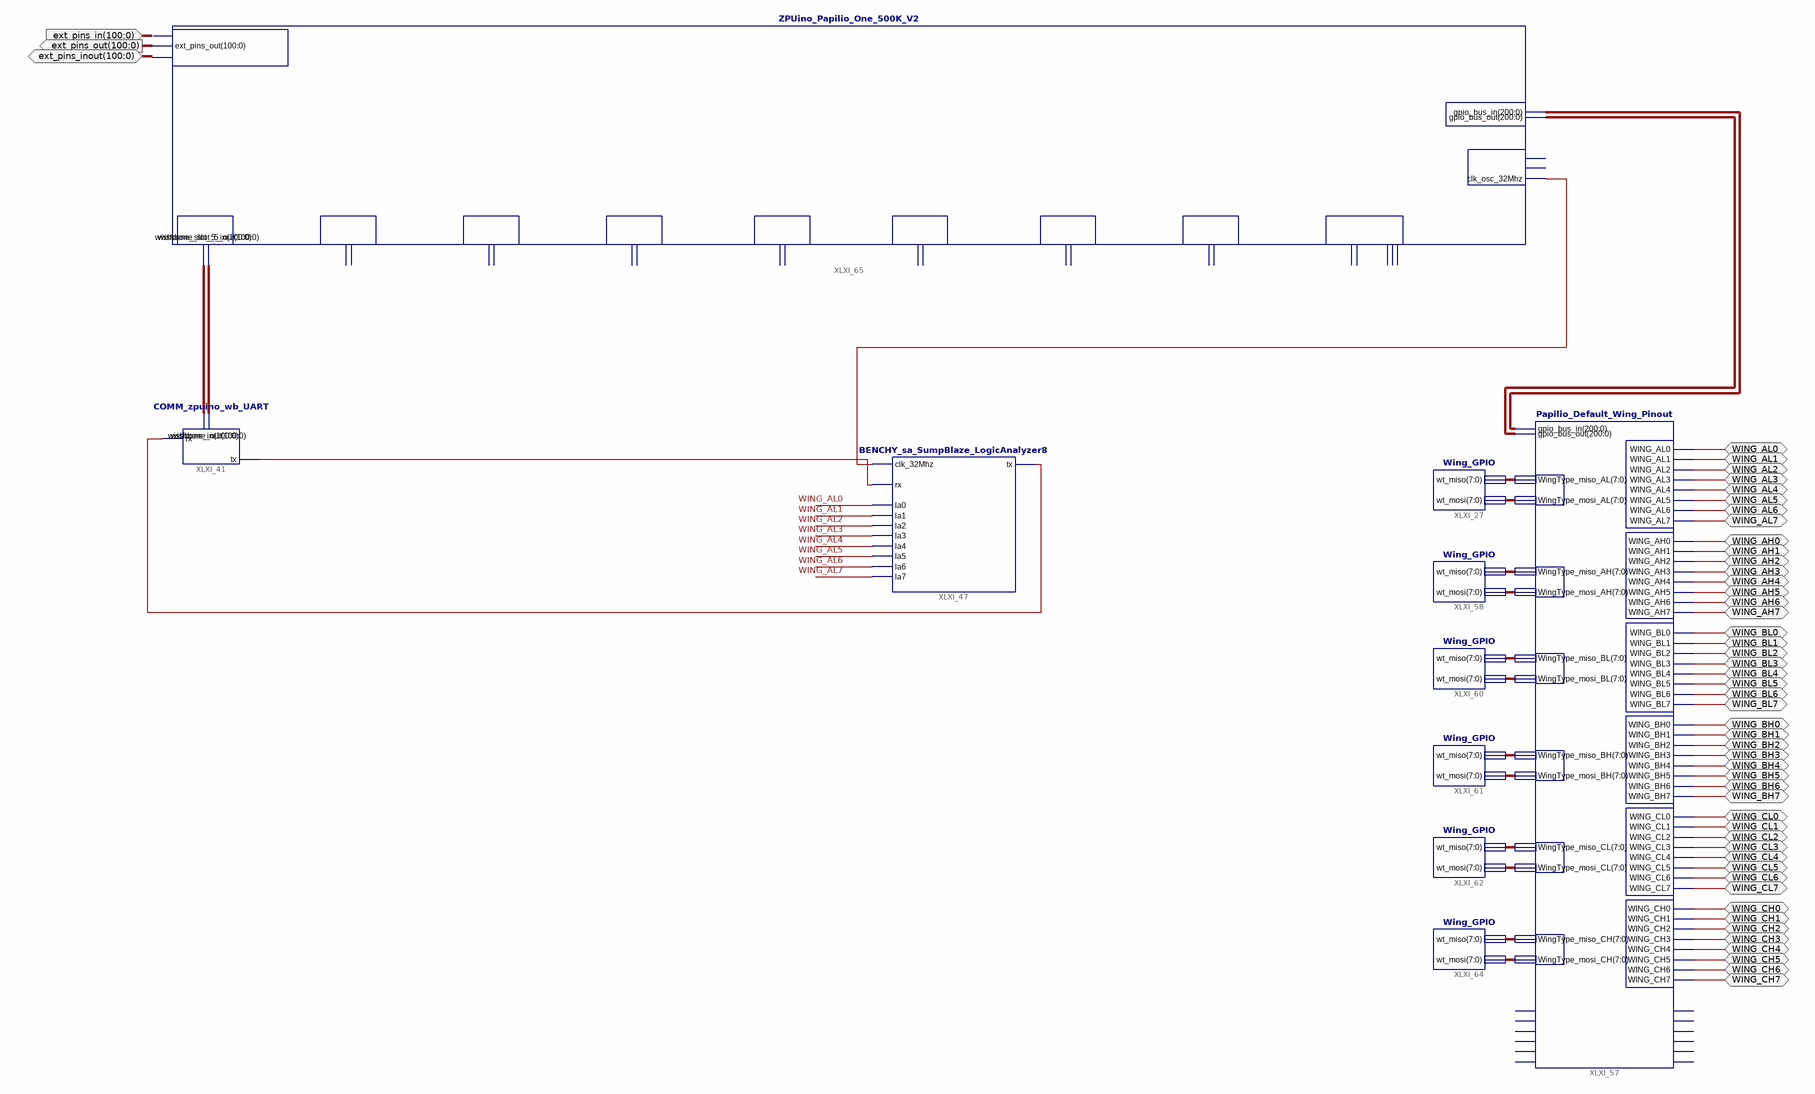
[diagram p0: schematic sheet 1]
// Xilinx ISE schematic Papilio_One_500K.sch (spartan3e) as structural Verilog: 10 symbols, 51 ports
module Papilio_One_500K (
  input  [100:0] ext_pins_in,
  inout  WING_AL0,
  inout  WING_AL1,
  inout  WING_AL2,
  inout  WING_AL3,
  inout  WING_AL4,
  inout  WING_AL5,
  inout  WING_AL6,
  inout  WING_AL7,
  inout  WING_AH0,
  inout  WING_AH1,
  inout  WING_AH2,
  inout  WING_AH3,
  inout  WING_AH4,
  inout  WING_AH5,
  inout  WING_AH6,
  inout  WING_AH7,
  inout  WING_BL0,
  inout  WING_BL1,
  inout  WING_BL2,
  inout  WING_BL3,
  inout  WING_BL4,
  inout  WING_BL5,
  inout  WING_BL6,
  inout  WING_BL7,
  inout  WING_BH0,
  inout  WING_BH1,
  inout  WING_BH2,
  inout  WING_BH3,
  inout  WING_BH4,
  inout  WING_BH5,
  inout  WING_BH6,
  inout  WING_BH7,
  inout  WING_CL0,
  inout  WING_CL1,
  inout  WING_CL2,
  inout  WING_CL3,
  inout  WING_CL4,
  inout  WING_CL5,
  inout  WING_CL6,
  inout  WING_CL7,
  inout  WING_CH0,
  inout  WING_CH1,
  inout  WING_CH2,
  inout  WING_CH3,
  inout  WING_CH4,
  inout  WING_CH5,
  inout  WING_CH6,
  inout  WING_CH7,
  inout  [100:0] ext_pins_inout,
  output [100:0] ext_pins_out
);

  wire XLXN_457, XLXN_466, XLXN_468;
  wire [7:0] XLXN_489, XLXN_490, XLXN_491, XLXN_492, XLXN_493, XLXN_494, XLXN_495, XLXN_496, XLXN_497,
       XLXN_498, XLXN_499, XLXN_500;
  wire [100:0] XLXN_509, XLXN_510;
  wire [200:0] XLXN_408, XLXN_409;

  Wing_GPIO XLXI_27 (.wt_miso(XLXN_489), .wt_mosi(XLXN_490));
  BENCHY_sa_SumpBlaze_LogicAnalyzer8 #(.brams(1)) XLXI_47 (
    .clk_32Mhz(XLXN_457), .la0(WING_AL0), .rx(XLXN_466), .tx(XLXN_468), .la1(WING_AL1), .la2(WING_AL2),
    .la3(WING_AL3), .la4(WING_AL4), .la5(WING_AL5), .la6(WING_AL6), .la7(WING_AL7));
  Papilio_Default_Wing_Pinout XLXI_57 (
    .WING_AH0(WING_AH0), .WING_AH1(WING_AH1), .WING_AH2(WING_AH2), .WING_AH3(WING_AH3), .WING_AH4(WING_AH4),
    .WING_AH5(WING_AH5), .WING_AH6(WING_AH6), .WING_AH7(WING_AH7), .WING_AL0(WING_AL0), .WING_AL1(WING_AL1),
    .WING_AL2(WING_AL2), .WING_AL3(WING_AL3), .WING_AL4(WING_AL4), .WING_AL5(WING_AL5), .WING_AL6(WING_AL6),
    .WING_AL7(WING_AL7), .WING_BH0(WING_BH0), .WING_BH1(WING_BH1), .WING_BH2(WING_BH2), .WING_BH3(WING_BH3),
    .WING_BH4(WING_BH4), .WING_BH5(WING_BH5), .WING_BH6(WING_BH6), .WING_BH7(WING_BH7), .WING_BL0(WING_BL0),
    .WING_BL1(WING_BL1), .WING_BL2(WING_BL2), .WING_BL3(WING_BL3), .WING_BL4(WING_BL4), .WING_BL5(WING_BL5),
    .WING_BL6(WING_BL6), .WING_BL7(WING_BL7), .WING_CL0(WING_CL0), .WING_CL1(WING_CL1), .WING_CL2(WING_CL2),
    .WING_CL3(WING_CL3), .WING_CL4(WING_CL4), .WING_CL5(WING_CL5), .WING_CL6(WING_CL6), .WING_CL7(WING_CL7),
    .WING_CH0(WING_CH0), .WING_CH1(WING_CH1), .WING_CH2(WING_CH2), .WING_CH3(WING_CH3), .WING_CH4(WING_CH4),
    .WING_CH5(WING_CH5), .WING_CH6(WING_CH6), .WING_CH7(WING_CH7), .gpio_bus_out(XLXN_408),
    .gpio_bus_in(XLXN_409), .WingType_miso_BH(XLXN_495), .WingType_miso_BL(XLXN_493),
    .WingType_miso_AH(XLXN_491), .WingType_mosi_BL(XLXN_494), .WingType_mosi_BH(XLXN_496),
    .WingType_mosi_CL(XLXN_498), .WingType_mosi_AH(XLXN_492), .WingType_miso_CL(XLXN_497),
    .WingType_miso_CH(XLXN_499), .WingType_mosi_CH(XLXN_500), .WingType_mosi_AL(XLXN_490),
    .WingType_miso_AL(XLXN_489));  // open: Flex_Pin_out_0, Flex_Pin_out_1, Flex_Pin_out_2, Flex_Pin_out_3, Flex_Pin_out_4, Flex_Pin_out_5, Flex_Pin_in_0, Flex_Pin_in_1, Flex_Pin_in_2, Flex_Pin_in_3, Flex_Pin_in_4, Flex_Pin_in_5
  Wing_GPIO XLXI_58 (.wt_miso(XLXN_491), .wt_mosi(XLXN_492));
  Wing_GPIO XLXI_60 (.wt_miso(XLXN_493), .wt_mosi(XLXN_494));
  Wing_GPIO XLXI_61 (.wt_miso(XLXN_495), .wt_mosi(XLXN_496));
  Wing_GPIO XLXI_62 (.wt_miso(XLXN_497), .wt_mosi(XLXN_498));
  Wing_GPIO XLXI_64 (.wt_miso(XLXN_499), .wt_mosi(XLXN_500));
  COMM_zpuino_wb_UART XLXI_41 (.rx(XLXN_468), .wishbone_in(XLXN_509), .wishbone_out(XLXN_510), .tx(XLXN_466));
  ZPUino_Papilio_One_500K_V2 XLXI_65 (
    .clk_osc_32Mhz(XLXN_457), .ext_pins_in(ext_pins_in), .ext_pins_out(ext_pins_out),
    .ext_pins_inout(ext_pins_inout), .gpio_bus_out(XLXN_408), .gpio_bus_in(XLXN_409),
    .wishbone_slot_5_out(XLXN_510), .wishbone_slot_5_in(XLXN_509));  // open: clk_96Mhz, clk_1Mhz, wishbone_slot_6_in, wishbone_slot_6_out, wishbone_slot_8_in, wishbone_slot_8_out, wishbone_slot_9_in, wishbone_slot_9_out, wishbone_slot_10_in, wishbone_slot_10_out, wishbone_slot_11_in, wishbone_slot_11_out, wishbone_slot_12_in, wishbone_slot_12_out, wishbone_slot_13_in, wishbone_slot_13_out, wishbone_slot_14_in, wishbone_slot_14_out, wishbone_slot_video_in, wishbone_slot_video_out, vgaclkout
endmodule
